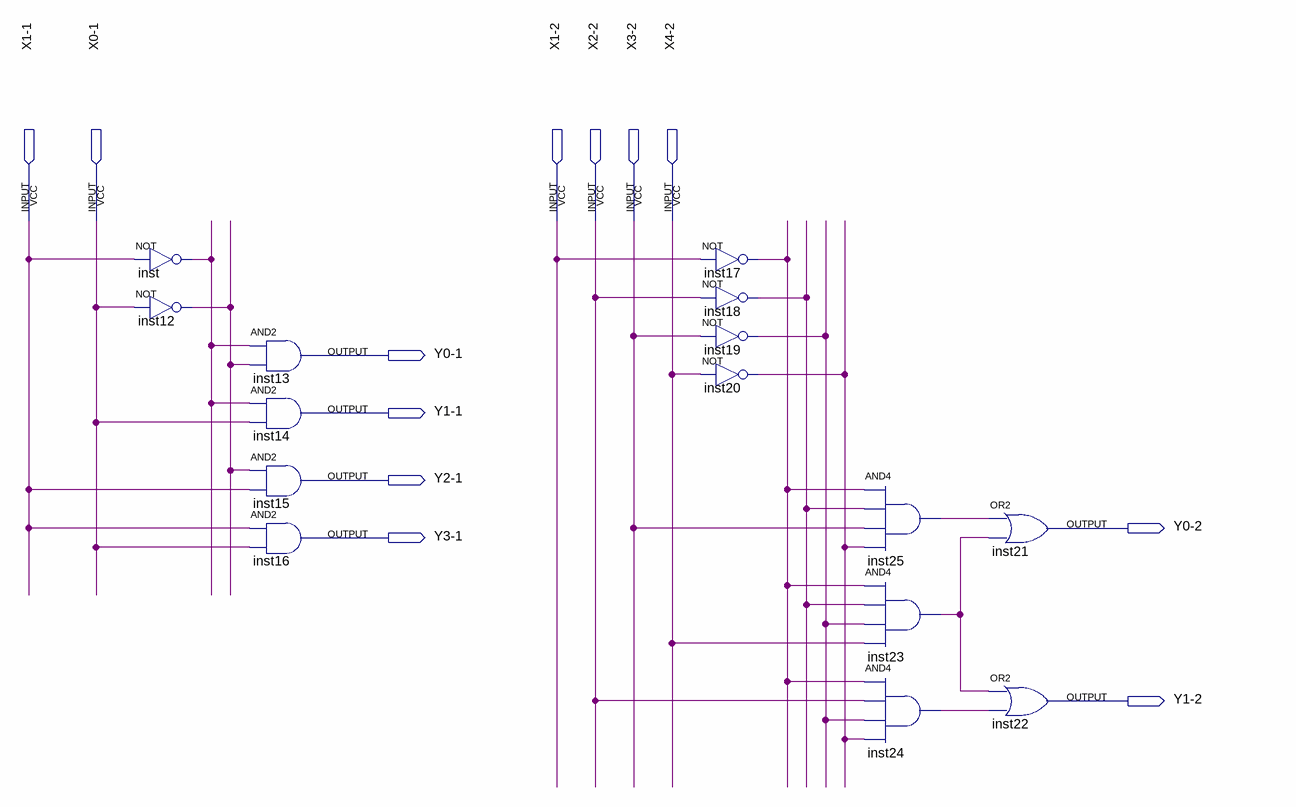
[diagram p0: schematic sheet]
// Quartus schematic lab3.bdf as structural Verilog: 15 symbols, 12 pins
module lab3 (
  input  \X1-1 ,
  input  \X0-1 ,
  input  \X1-2 ,
  input  \X2-2 ,
  input  \X3-2 ,
  input  \X4-2 ,
  output \Y0-1 ,
  output \Y1-1 ,
  output \Y2-1 ,
  output \Y0-2 ,
  output \Y3-1 ,
  output \Y1-2 
);

  wire inst12_out, inst17_out, inst18_out, inst19_out, inst20_out, inst23_out, inst24_out, inst25_out,
       inst_out;

  not inst (inst_out, \X1-1 );
  not inst12 (inst12_out, \X0-1 );
  and inst13 (\Y0-1 , inst_out, inst12_out);
  and inst14 (\Y1-1 , inst_out, \X0-1 );
  and inst15 (\Y2-1 , inst12_out, \X1-1 );
  and inst16 (\Y3-1 , \X1-1 , \X0-1 );
  not inst17 (inst17_out, \X1-2 );
  not inst18 (inst18_out, \X2-2 );
  not inst19 (inst19_out, \X3-2 );
  not inst20 (inst20_out, \X4-2 );
  and inst25 (inst25_out, inst17_out, inst18_out, \X3-2 , inst20_out);
  and inst23 (inst23_out, inst17_out, inst18_out, inst19_out, \X4-2 );
  and inst24 (inst24_out, inst17_out, \X2-2 , inst19_out, inst20_out);
  or inst21 (\Y0-2 , inst25_out, inst23_out);
  or inst22 (\Y1-2 , inst23_out, inst24_out);
endmodule
